# EAGLE design u-nex_v1 (EAGLE 6.5.0)
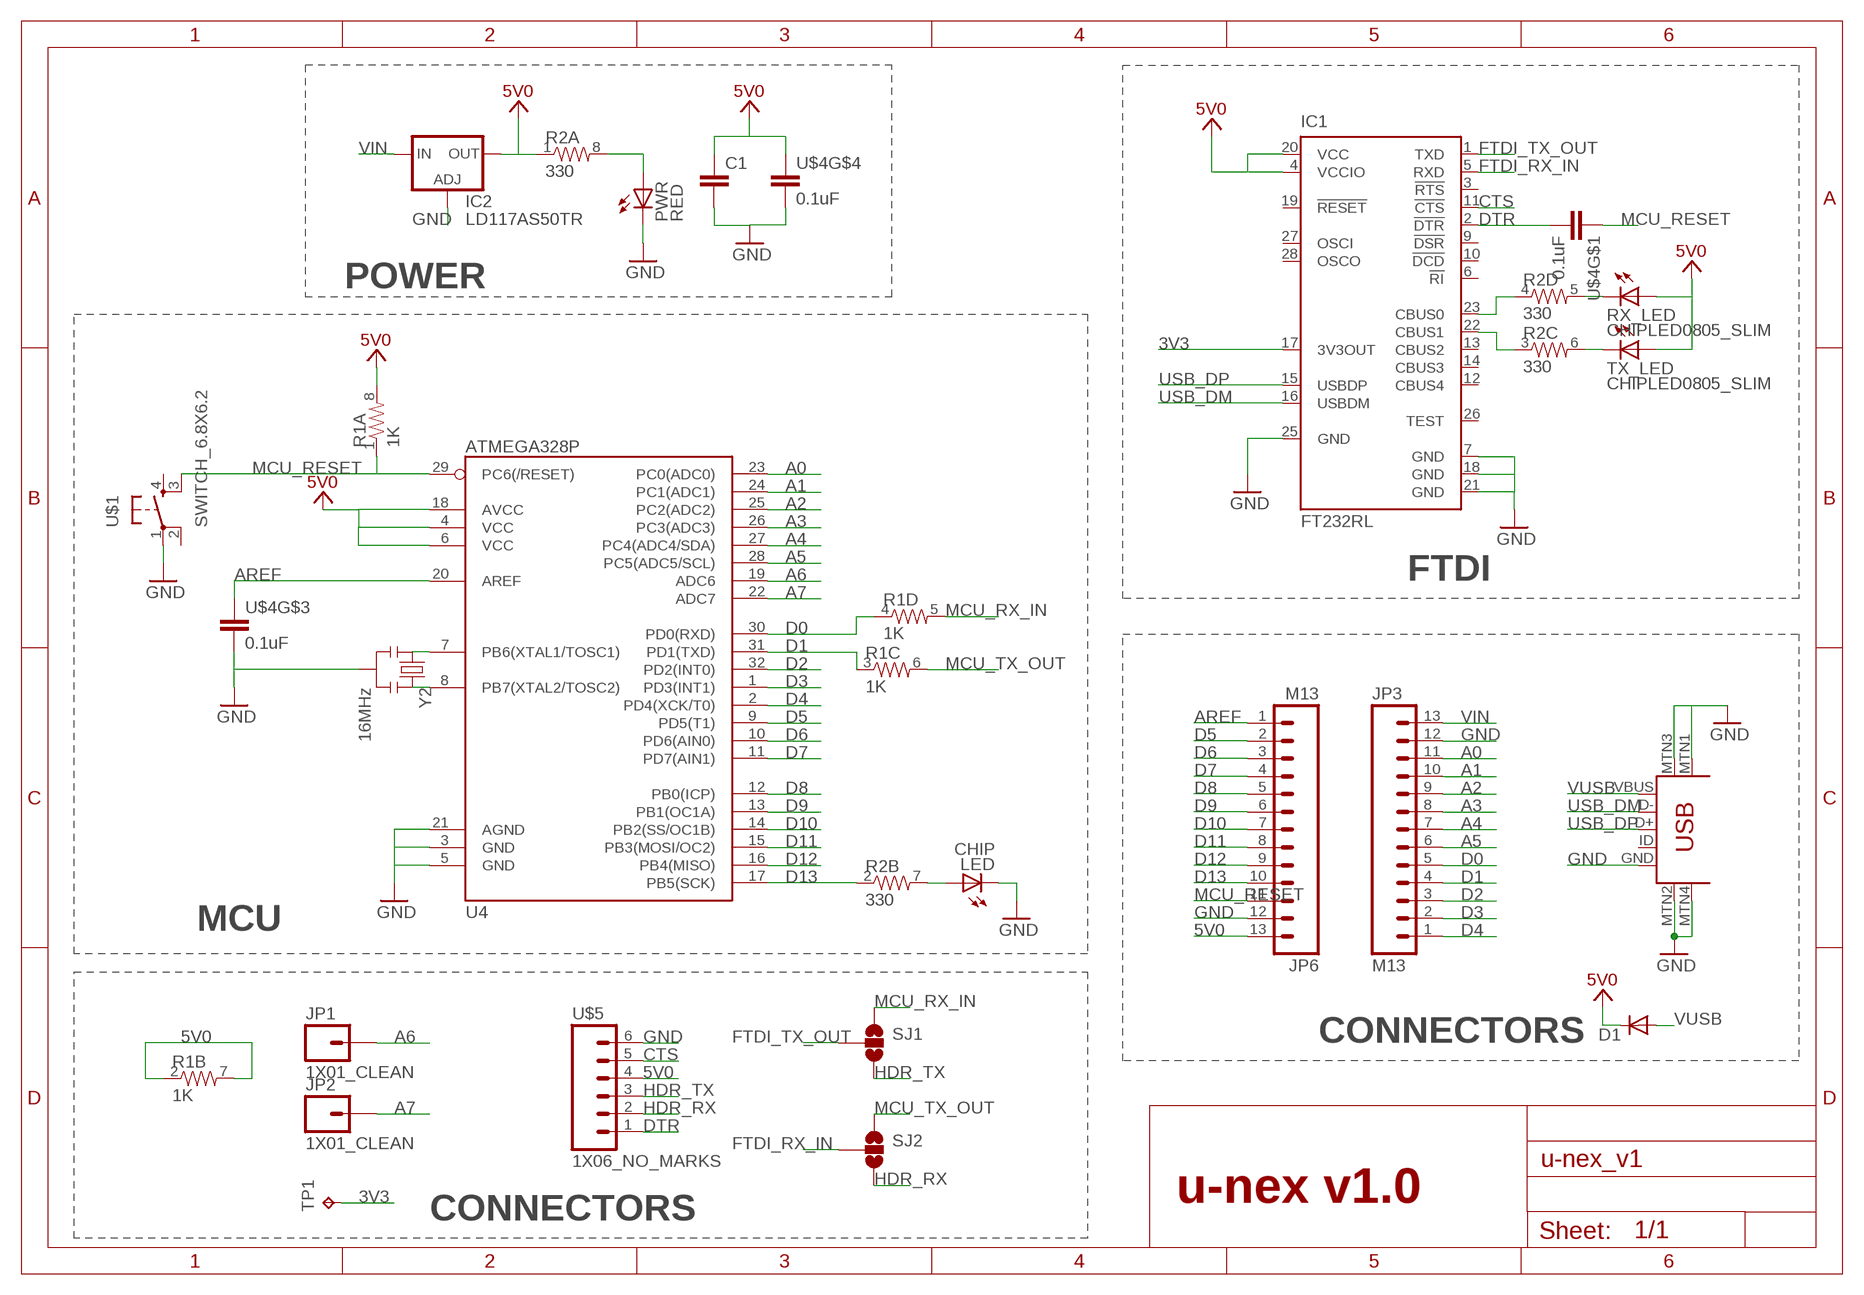
[diagram p0: schematic, sheet 1]

## Parts
C1  CAP0805  [0805]
D1  DIODESOD  [SOD-323]
IC1  FT232RL  [SSOP28]
IC2  LD117AS50TR  [SOT223]
JP1  1X01_CLEAN  [1X01_CLEAN]
JP2  1X01_CLEAN  [1X01_CLEAN]
JP3  M13  [1X13]
JP6  M13  [1X13]
LED  CHIP  CHIPLED0805_SLIM  [CHIPLED0805]
PWR  RED  CHIPLED0805_SLIM  [CHIPLED0805]
R1  1K  RES_ARRAY_4X0603  [0603_ARV]
R2  330  RES_ARRAY_4X0603  [0603_ARV]
RX_LED  CHIPLED0805_SLIM  [CHIPLED0805]
SJ1  SOLDERJUMPER_2WAYS  [SJ_3]
SJ2  SOLDERJUMPER_2WAYS  [SJ_3]
TP1  TPB1,27  [B1,27]
TX_LED  CHIPLED0805_SLIM  [CHIPLED0805]
U4  ATMEGA328P  ATMEGA328_SMT  [TQFP32-08]
U$1  SWITCH_6.8X6.2  [SWITCH_6.8X6.2]
U$4  0.1uF  CAP_ARRAY_0603  [0603_ARV]
U$5  1X06_NO_MARKS  [1X06_CLEAN]
U$9  USB-MINIB-5PIN  [USB-MINIB]
Y2  16MHz  RESONATOR_SMD  [RESONATOR_SMD]

## Nets
3V3: IC1.17(3V3OUT) TP1.TP
5V0: C1.1 D1.1(C) IC1.4(VCCIO) IC1.20(VCC) IC2.4(OUT) JP6.13 R1.2 R1.7 R1.8 R2.1 RX_LED.A TX_LED.A U4.4(VCC) U4.6(VCC) U4.18(AVCC) U$4.4 U$5.4
A0: JP3.11 U4.23(PC0(ADC0))
A1: JP3.10 U4.24(PC1(ADC1))
A2: JP3.9 U4.25(PC2(ADC2))
A3: JP3.8 U4.26(PC3(ADC3))
A4: JP3.7 U4.27(PC4(ADC4/SDA))
A5: JP3.6 U4.28(PC5(ADC5/SCL))
A6: JP1.1 U4.19(ADC6)
A7: JP2.1 U4.22(ADC7)
AREF: JP6.1 U4.20(AREF) U$4.3
CTS: IC1.11(!CTS) U$5.5
D0: JP3.5 R1.4 U4.30(PD0(RXD))
D1: JP3.4 R1.3 U4.31(PD1(TXD))
D2: JP3.3 U4.32(PD2(INT0))
D3: JP3.2 U4.1(PD3(INT1))
D4: JP3.1 U4.2(PD4(XCK/T0))
D5: JP6.2 U4.9(PD5(T1))
D6: JP6.3 U4.10(PD6(AIN0))
D7: JP6.4 U4.11(PD7(AIN1))
D8: JP6.5 U4.12(PB0(ICP))
D9: JP6.6 U4.13(PB1(OC1A))
D10: JP6.7 U4.14(PB2(SS/OC1B))
D11: JP6.8 U4.15(PB3(MOSI/OC2))
D12: JP6.9 U4.16(PB4(MISO))
D13: JP6.10 R2.2 U4.17(PB5(SCK))
DTR: IC1.2(!DTR) U$4.8 U$5.1
FTDI_RX_IN: IC1.5(RXD) SJ2.2
FTDI_TX_OUT: IC1.1(TXD) SJ1.2
GND: C1.2 IC1.7(GND) IC1.18(GND) IC1.21(GND) IC1.25(GND) IC2.1(ADJ) JP3.12 JP6.12 LED.C PWR.C U4.3(GND) U4.5(GND) U4.21(AGND) U$1.1 U$4.5 U$4.6 U$5.6 U$9.GND U$9.MTN1(MTN2) U$9.MTN2(MTN3) U$9.MTN3(MTN1) U$9.MTN4 Y2.2
HDR_RX: SJ2.3 U$5.2
HDR_TX: SJ1.3 U$5.3
MCU_RESET: JP6.11 R1.1 U4.29(PC6(/RESET)) U$1.3 U$4.1
MCU_RX_IN: R1.5 SJ1.1
MCU_TX_OUT: R1.6 SJ2.1
N$1: LED.A R2.7
N$2: R2.5 RX_LED.C
N$3: R2.6 TX_LED.C
N$5: IC1.22(CBUS1) R2.3
N$33: IC1.23(CBUS0) R2.4
N$35: PWR.A R2.8
N$54: U4.7(PB6(XTAL1/TOSC1)) Y2.1
N$55: U4.8(PB7(XTAL2/TOSC2)) Y2.3
USB_DM: IC1.16(USBDM) U$9.D-
USB_DP: IC1.15(USBDP) U$9.D+
VIN: IC2.3(IN) JP3.13
VUSB: D1.2(A) U$9.VBUS
Unconnected: IC1.3(!RTS) IC1.6(!RI) IC1.9(!DSR) IC1.10(!DCD) IC1.12(CBUS4) IC1.13(CBUS2) IC1.14(CBUS3) IC1.19(!RESET) IC1.26(TEST) IC1.27(OSCI) IC1.28(OSCO) U$1.2 U$1.4 U$4.2 U$4.7 U$9.ID

## Notes on the sheet
- POWER
- FTDI
- MCU
- CONNECTORS
- u-nex v1.0
- CONNECTORS

## Library data of the parts
C1 = SparkFun-Capacitors:CAP: Capacitor Standard 0603 ceramic capacitor, and 0.1" leaded capacitor.
D1 = SparkFun-DiscreteSemi:DIODE: Diode These are standard reverse protection diodes and small signal diodes. SMA package can handle up to about 1A. SOD-323 can handle about 200mA. What the SOD-323 package when ordering, there are some mfgs out there that are 5-pin packages.
IC1 = ftdichip:FT232R: Source: http://www.ftdichip.com/Documents/DataSheets/DS_FT232R_v104.pdf; MPN: FT232RL; OC_FARNELL: 1146032; OC_NEWARK: 91K9918
IC2 = v-reg:LD117A?*: Low drop fixed and adjustable positive voltage regulators 1 A Source: http://www.st.com/stonline/products/literature/ds/7194/ld1117axx.pdf
JP1 JP2 = Frenoy_Custom:1X01_CLEAN
JP3 JP6 = Frenoy_custom_GOA:M13
LED PWR RX_LED TX_LED = Frenoy_Custom:CHIPLED0805_SLIM
R1 R2 = Frenoy_Custom:RES_ARRAY_4X0603
SJ1 SJ2 = SparkFun-Passives:SOLDERJUMPER_2WAY: Solder Jumper 2 way solder jumper
TP1 = testpad:TP: Test pad
U4 = SparkFun-DigitalIC:ATMEGA328_SMT: 32-Pin Atmega328 part Commonly used on Arduino compatible boards Available in QFP and QFN packages TQFP is IC-09069 QFN is non-stock; PROD_ID: IC-09069
U$1 = Frenoy_Custom:SWITCH_6.8X6.2
U$4 = Frenoy_Custom:CAP_ARRAY_0603
U$5 = Frenoy_Custom:1X06_NO_MARKS
U$9 = SparkFun-Connectors:USB-MINIB: Mini-USB "B" connector with 5th pin broken out. Created new symbol breaking out 5th "ID" pin in mini/micro USB connector spec. See: http://en.wikipedia.org/wiki/Mini_usb#Cables. Uses same footprint as 4-pin symbol. Also added pins to connect to mounting / shield pads if required (probably not generally needed as signals aren't shielded once they leave the connector).
Y2 = Frenoy_custom_GOA:RESONATOR_SMD

## Board
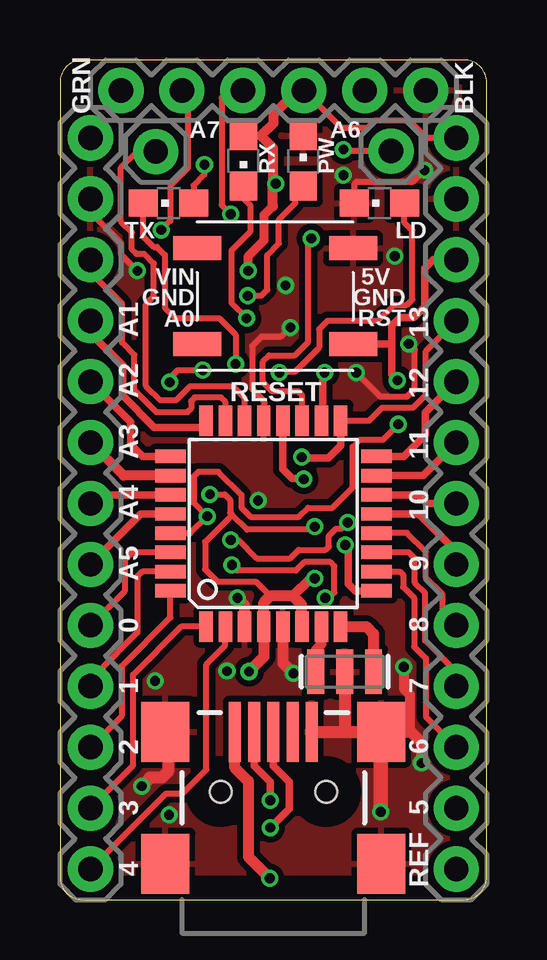
[diagram p1: board, top side]
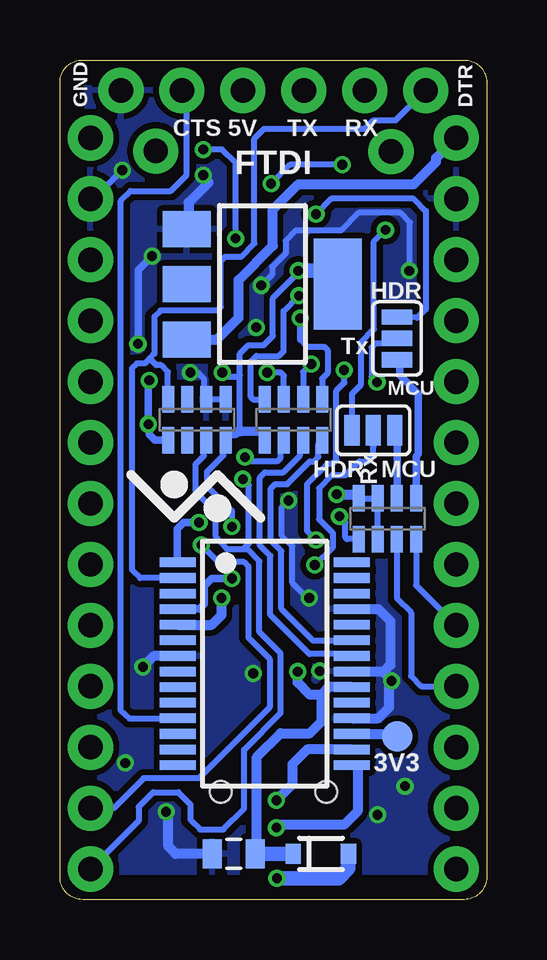
[diagram p2: board, bottom side, seen from below]

Size 17.78 x 35 mm. Coordinates in mm from the lower left corner, seen from the top.
Outline: 17.78,0.94 17.78,34.06 arc90 16.84,35 0.94,35 arc90 0,34.06 0,0.94 arc90 0.94,0 16.84,0 arc90 17.78,0.94
Copper layers (1*16): Top 0.035mm / dielectric 1.5mm / Bottom 0.035mm
Design rules "default": minimum track width 10mil, minimum drill 16mil, track to track 8mil, track to pad 8mil, pad to pad 8mil, via to via 8mil, smd to smd 8mil, copper to edge 40mil, drill to drill 8mil, minimum pad ring 10mil, minimum via ring 6mil, stop-mask expansion 4mil, vias tented up to drill 16mil, thermal gap 10mil

### Footprints (pad centres in the part's own frame; a part is rotated, then mirrored left to right if it is on the bottom)
0805 = smd 0.8 x 1.2: 1 -0.9,0; 2 0.9,0
SOD-323 = smd 0.63 x 0.83: 1 -1.15,0; 2 1.15,0
SSOP28 = smd 0.4 x 1.5: 1 -4.225,-3.625; 2 -3.575,-3.625; 3 -2.925,-3.625; 4 -2.275,-3.625; 5 -1.625,-3.625; 6 -0.975,-3.625; 7 -0.325,-3.625; 8 0.325,-3.625; 9 0.975,-3.625; 10 1.625,-3.625; 11 2.275,-3.625; 12 2.925,-3.625; 13 3.575,-3.625; 14 4.225,-3.625; 15 4.225,3.625; 16 3.575,3.625; 17 2.925,3.625; 18 2.275,3.625; 19 1.625,3.625; 20 0.975,3.625; 21 0.325,3.625; 22 -0.325,3.625; 23 -0.975,3.625; 24 -1.625,3.625; 25 -2.275,3.625; 26 -2.925,3.625; 27 -3.575,3.625; 28 -4.225,3.625
SOT223 = smd 1.5 x 2: 1 -2.3,-3.15; 2 0,-3.15; 3 2.3,-3.15 | smd 3.8 x 2: 4 0,3.15
1X01_CLEAN = drill 1.016 pad 1.88: 1 0,0
1X13 = drill 1.016 pad 1.88: 1 0,0; 2 2.54,0; 3 5.08,0; 4 7.62,0; 5 10.16,0; 6 12.7,0; 7 15.24,0; 8 17.78,0; 9 20.32,0; 10 22.86,0; 11 25.4,0; 12 27.94,0; 13 30.48,0
CHIPLED0805 = smd 1.143 x 1.2: A 0,-1.05; C 0,1.05
0603_ARV = smd 0.5 x 1.1: 1 -1.2,-0.85; 2 -0.4,-0.85; 3 0.4,-0.85; 4 1.2,-0.85; 5 1.2,0.85; 6 0.4,0.85; 7 -0.4,0.85; 8 -1.2,0.85
SJ_3 = smd 0.635 x 1.27: 1 -0.889,0; 2 0,0; 3 0.889,0
B1,27 = smd 1.27 x 1.27: TP 0,0
TQFP32-08 = smd 1.27 x 0.559: 1 -4.293,2.8; 2 -4.293,2; 3 -4.293,1.2; 4 -4.293,0.4; 5 -4.293,-0.4; 6 -4.293,-1.2; 7 -4.293,-2; 8 -4.293,-2.8; 17 4.293,-2.8; 18 4.293,-2; 19 4.293,-1.2; 20 4.293,-0.4; 21 4.293,0.4; 22 4.293,1.2; 23 4.293,2; 24 4.293,2.8 | smd 0.559 x 1.27: 9 -2.8,-4.293; 10 -2,-4.293; 11 -1.2,-4.293; 12 -0.4,-4.293; 13 0.4,-4.293; 14 1.2,-4.293; 15 2,-4.293; 16 2.8,-4.293; 25 2.8,4.293; 26 2,4.293; 27 1.2,4.293; 28 0.4,4.293; 29 -0.4,4.293; 30 -1.2,4.293; 31 -2,4.293; 32 -2.8,4.293
SWITCH_6.8X6.2 = smd 1 x 2: 1 -2,3.25; 2 -2,-3.25; 3 2,3.25; 4 2,-3.25
1X06_CLEAN = drill 1.016 pad 1.88: 1 -6.35,0; 2 -3.81,0; 3 -1.27,0; 4 1.27,0; 5 3.81,0; 6 6.35,0
USB-MINIB = smd 2.5 x 0.5: D+ 2.5,0; D- 2.5,0.8; GND 2.5,-1.6; ID 2.5,-0.8; VBUS 2.5,1.6 | smd 2.5 x 2: MTN1 -3,4.5; MTN2 2.5,4.5; MTN3 -3,-4.5; MTN4 2.5,-4.5 | hole 0.9: 0,2.2; 0,-2.2
RESONATOR_SMD = smd 0.7 x 1.854: 1 -1.2,0; 2 0,0; 3 1.2,0

### Placement (x,y rotation side)
C1  10.54,1.91 180 bottom
D1  6.91,1.91 0 bottom
IC1  9.25,9.83 270 bottom
IC2  9.35,25.65 270 bottom
JP1  13.79,31.2 0 top
JP2  3.99,31.18 0 top
JP3  1.27,1.27 90 top
JP6  16.51,1.27 90 top
LED  13.31,29.03 90 top
PWR  10.13,30.78 0 top
R1  4.14,15.88 0 bottom
R2  8.05,20 0 bottom
RX_LED  7.65,30.78 180 top
SJ1  3.73,23.39 90 bottom
SJ2  4.72,19.56 180 bottom
TP1  3.73,6.81 0 bottom
TX_LED  4.52,29.03 90 top
U4  8.89,15.67 90 top
U$1  8.97,25.15 270 top
U$4  12.08,20 0 bottom
U$5  8.89,33.73 0 top
U$9  8.89,4.5 90 top
Y2  11.86,9.5 0 top

### Tracks (layer width: path | path; a pad name or v marks a point on that pad's centre or on a via)
3V3
  Bottom 0.406: 3.71,6.63 TP1.TP | 3.55,6.91 TP1.TP | IC1.17 3.83,6.91 TP1.TP
5V0  (via drill 0.41, 0.41 pad 0.64, 0.41 pad 0.71)
  Top 0.254: 8.76,12.65 8.15,13.26 6.55,13.26 6.04,13.77 6.04,14.91 7.18,16.04 | JP6.13 15.29,31.75 14.55,32.47 13.12,32.47 12.8,32.16 11.73,32.16 U$5.4 | v10.62,15.54 10.49,15.42 7.8,15.42 7.18,16.04 | v6.25,16.89 6.86,16.89 7.09,16.66 7.09,16.13 7.18,16.04 | v6.02,30.63 6.02,30.23 5.56,29.77 5.56,29.04 TX_LED.A
  Top 0.305: U4.18 10.85,20.09 10.95,19.56 10.95,21.89 v11.02,21.97 | 8.37,31.84 RX_LED.A
  Top 0.381: v7.85,26.21 7.85,26.82 8.51,27.48 8.51,28.55 8.87,28.91
  Top 0.406: v10.62,13.39 10.44,13.39 9.7,12.65 | U$5.4 9.9,33.73 8.89,32.72 8.89,32.35 8.37,31.84 8.87,31.34 8.87,29.97 v8.99,29.85 8.87,29.73 8.87,28.91
  Top 0.457: v7.87,9.5 8.49,10.12 U4.4 8.49,12.38 8.76,12.65 9.7,12.65 | 9.7,12.65 10.06,12.29 10.06,11.41 U4.6 | 9.7,12.65 9.73,12.65
  Bottom 0.254: R1.2 R1.7 R1.8 | 10.85,19.13 U$4.4 10.97,19.04 10.97,18.52 11.66,17.83 11.66,17.25 10.62,16.2 v10.62,15.54 | 10.29,19.58 10.29,21.84 | 10.29,21.84 10.29,22.76 9.93,23.11 9.3,23.11 8.91,23.5 8.91,25.07 7.85,26.14 v7.85,26.21 | v11.02,21.97 10.87,21.81 10.29,21.81 10.29,21.84 | v6.02,30.63 8.2,30.63 v8.99,29.85
  Bottom 0.305: IC1.4 11.97,12.11 11.76,12.32 11.76,13.08 11.46,13.39 v10.62,13.39
  Bottom 0.381: R2.1 9.2,19.49 9.22,19.51 10.21,19.51 10.29,19.58 10.44,19.43 10.87,19.43 U$4.4
  Bottom 0.406: 9.65,1.84 C1.1 | 9.63,1.84 C1.1 | C1.1 9.58,1.97 9.58,5.94 8.59,6.93 7.37,6.93 6.88,7.42 6.88,8.48 6.93,8.53 | IC1.20 6.56,8.86 6.88,8.53 6.93,8.53 | 6.93,8.53 7.37,8.53 7.87,9.04 v7.87,9.5 | v6.25,16.89 5.51,16.89 R1.8
  Bottom 0.61: 5.61,25.58 IC2.4 6.68,26.21 v7.85,26.21 | C1.1 D1.1
  Bottom 0.66: 6.38,25.86 IC2.4
A0
  Top 0.254: JP3.11 1.27,26.16 2.59,24.84 2.59,23.22 3.1,22.71 3.1,21.23 4.01,20.32 5.31,20.32 5.46,20.47 5.46,20.78 5.61,20.93 6.71,20.93 6.88,20.75 U4.23
A1
  Top 0.305: JP3.10 1.27,23.62 2.62,22.28 2.62,21.01 3.94,19.68 5.99,19.68 6.09,19.78 U4.24
A2
  Top 0.305: U4.25 3.45,18.47 2.95,18.97 2.95,19.91 JP3.9
A3
  Top 0.406: U4.26 2.65,17.67 JP3.8
A4
  Top 0.305: U4.27 1.63,16.87 JP3.7
A5
  Top 0.305: U4.28 3.37,16.07 JP3.6
A6  (via drill 0.41, 0.41 pad 0.71)
  Top 0.254: U4.19 10.09,21.02 9.93,21.18 8.84,21.18 8.46,21.57 8.46,22.43 8.71,22.68 9.78,22.68 10.34,23.24 10.34,27.43 v10.46,27.56 | JP1.1 11.87,31.2 v11.81,31.27
  Bottom 0.254: v10.46,27.56 10.46,30.71 11.02,31.27 v11.81,31.27
A7
  Top 0.254: U4.22 7.69,20.91 7.21,21.39 5.41,21.39 4.83,20.8 4.19,20.8 3.58,21.41 3.58,24.82 3.91,25.15 3.91,26.52 3.5,26.92 3.17,26.92 3,27.1 3,27.81 2.54,28.27 2.54,30.5 3.2,31.17 3.97,31.17 JP2.1
AREF  (via drill 0.41 pad 0.71)
  Top 0.305: U4.20 9.29,17.94 9.68,17.55 10.13,17.55 v10.16,17.52
  Bottom 0.254: JP6.1 14.5,3.28 14.5,3.86 13.89,4.47 12.85,4.47 12.34,3.96 12.34,3.33 11.94,2.92 10.97,2.92 10.11,3.79 10.11,6.25 8.59,7.77 8.59,10.26 9.47,11.15 9.47,14.1 9.98,14.61 10.13,14.61 | 11.68,19.13 U$4.3 11.79,19.03 11.79,18.49 12.14,18.14 12.14,17.02 11.3,16.18 11.3,15.16 10.82,14.61 10.13,14.61 | 10.13,14.61 9.91,14.83 9.91,17.27 v10.16,17.52
CTS
  Bottom 0.254: 12.6,7.59 IC1.11 | 12.91,7.54 IC1.11 | IC1.11 12.88,7.54 14.88,7.54 15.24,7.87 15.24,29.13 14.83,29.54 13.16,29.54 12.5,30.2 12.5,33.53 U$5.5
D0
  Top 0.254: U4.30 3.02,14.47 2.69,14.15 2.69,12.85 JP3.5
  Bottom 0.254: R1.4 2.94,13.1 JP3.5
D1
  Top 0.254: U4.31 3.44,13.67 3.23,13.46 3.23,11.12 1.57,9.47 1.57,9.2 JP3.4
  Bottom 0.254: JP3.4 2.72,8.89 3.15,9.32 3.15,11.96 3.74,12.55 R1.3
D2
  Top 0.254: JP3.3 2.56,7.64 2.56,9.73 4.6,11.76 U4.32
D3
  Top 0.254: JP3.2 3.05,5.59 3.05,9.37 5.05,11.38 U4.1
D4
  Top 0.254: JP3.1 4.42,4.42 5.11,4.42 6.1,5.41 6.1,9.8 6.88,10.59 U4.2
D5  (via drill 0.41 pad 0.71)
  Top 0.305: U4.9 12.3,12.87 12.01,13.16 12.01,14.66 v11.89,14.78
  Bottom 0.254: v11.89,14.78 11.18,14.07 10.11,14.07 9.93,13.89 9.93,10.92 9.04,10.03 9.04,8 11.99,5.05 14.3,5.05 15.54,3.81 JP6.2
D6
  Top 0.254: JP6.3 15.24,7.62 15.24,10.06 14.76,10.54 14.76,12.57 14.3,13.03 14.3,13.54 14.17,13.67 U4.10
D7
  Top 0.254: JP6.4 16.51,9.5 15.21,10.79 15.21,12.78 14.78,13.21 14.78,14.22 14.53,14.48 U4.11
D8
  Top 0.254: JP6.5 15.93,12.01 15.93,12.75 15.24,13.44 15.24,14.5 14.45,15.29 13.2,15.29 U4.12
  Top 0.305: 13.23,15.39 U4.12
D9
  Top 0.305: U4.13 14.94,16.07 16.48,14.53 16.48,13.99 JP6.6
D10
  Top 0.305: U4.14 14.93,16.87 15.29,16.51 JP6.7
D11
  Top 0.254: 13.37,17.78 U4.15 | 13.26,17.83 U4.15 | 13.27,17.73 U4.15
  Top 0.305: U4.15 15.13,17.67 JP6.8
D12
  Top 0.305: U4.16 14.33,18.47 15.21,19.36 15.21,20.3 JP6.9
D13  (via drill 0.41 pad 0.71)
  Top 0.254: U4.17 12.88,19.96 13.41,20.5 14.71,20.5 15.24,21.03 15.24,22.86 JP6.10
  Top 0.305: U4.17 11.69,18.93 11.18,18.41 10.1,18.41 v10.07,18.44
  Bottom 0.254: R2.2 8.59,19.02 8.59,18.41 8.74,18.26 9.89,18.26 v10.07,18.44
DTR
  Bottom 0.254: 13.26,21.05 13.23,20.57 | IC1.2 14.45,13.4 14.78,13.74 14.78,22.15 14.58,22.35 14.25,22.35 14.05,22.55 | U$4.8 13.28,20.87 13.28,22 13.56,22.28 13.77,22.28 14.05,22.55 | 14.05,22.55 13.84,22.76 13.84,24.31 13.59,24.56 11.23,24.56 11.07,24.71 11.07,26.62 10.9,26.8 10.24,26.8 9.68,27.36 9.68,31.73 9.27,32.13 5.08,32.13 4.72,32.49 3.79,32.49 U$5.1
  Bottom 0.305: 13.26,21.05 U$4.8
FTDI_RX_IN  (via drill 0.41 pad 0.64, 0.41 pad 0.71)
  Top 0.254: v11.05,12.57 11.2,12.57 11.43,12.8 11.43,13.89 11.25,14.07 10.19,14.07 9.83,13.72 7.39,13.72 v7.16,13.95
  Bottom 0.254: v7.16,13.95 6.4,14.71 6.4,15.27 6.99,15.85 6.99,17.14 6.45,17.68 5.89,17.68 5.31,18.26 4.95,18.26 4.72,18.49 SJ2.2 4.72,18.87
  Bottom 0.406: IC1.5 11.46,11.46 11.05,11.86 v11.05,12.57
FTDI_TX_OUT  (via drill 0.41 pad 0.64, 0.41 pad 0.71)
  Top 0.254: v11.99,15.72 11.73,15.47 11.51,15.47 11.2,15.16 11.2,14.71 11.07,14.58 9.96,14.58 9.6,14.22 8.2,14.22 7.44,14.99 v7.11,14.99 | v4.57,21.57 4.57,21.74 4.9,22.07 v5.94,22.07
  Bottom 0.254: v4.57,21.57 4.8,21.79 4.8,23.01 4.62,23.19 3.79,23.19 SJ1.2 | v7.11,14.99 7.49,15.37 7.49,17.32 6.66,18.16 6.43,18.16 6.26,18.33 6.26,21.22 5.93,21.55 v5.93,22.06 v5.94,22.07
  Bottom 0.305: IC1.1 12.9,14.06 12.9,15.44 12.62,15.72 v11.99,15.72
GND  (via drill 0.41, 0.41 pad 0.64, 0.41 pad 0.71)
  Top 0.254: 13.62,1.14 13.62,1.27 U$9.MTN3 | U4.21 8.51,19.98 8.51,20.78 8,21.29 8,23.06 8.41,23.47 9.22,23.47 v9.6,23.85 | JP3.12 1.27,28.65 2.54,27.38 2.54,26.9 v3.23,26.21 | v15.19,30.4 14.72,29.93 12.38,29.93 12.27,29.82 12.27,29.04 LED.C | v14.53,23.16 14.78,22.91 14.78,21.29 14.45,20.95 13.36,20.95 v12.34,21.97
  Top 0.406: 10.49,6.98 U$9.GND | v14.33,9.7 14.33,8.79 14.58,8.53 14.58,7.04 14.62,7
  Top 0.457: U$9.MTN4 14.12,7 14.62,7 15.06,6.55 v15.06,5.69 | U4.5 9.29,9.86 v9.73,9.42 | 7.37,12.57 v7.39,12.57 7.67,12.29 7.67,11.53
  Top 0.508: U$9.GND 11.86,7 | 11.86,7 U$9.MTN4 | Y2.2 11.86,7 | 4.5,6.08 4.5,5.34 4.24,5.08 3.76,5.08 v3.4,4.72
  Top 0.61: 13.82,1.14 13.62,1.14 | 13.3,6.99 U$9.MTN4 | 13.3,7.01 U$9.MTN4 | 14.1,7.02 14.12,7 | v13.36,3.66 13.36,6.97 U$9.MTN4
  Bottom 0.254: v12.34,21.97 12.04,21.97 11.79,21.72 11.79,20.97 U$4.6 U$4.5 | v7.39,12.57 7.47,12.57 8.1,13.21 8.1,14.73 8.53,15.16 8.53,16.36 v8.26,16.64 | JP6.12 16.38,29.21 v15.19,30.4 | v9.4,25.6 8.94,26.06 8.94,26.36 8.38,26.92 8.38,27.46 7.95,27.89 6.07,27.89 5.33,28.63 3.61,28.63 3.2,28.22 3.2,26.24 v3.23,26.21
  Bottom 0.305: v14.53,23.16 14.53,26.24 v13.95,26.82
  Bottom 0.406: 11.48,1.87 C1.2 12.96,1.91 13.26,2.21 13.26,3.56 v13.36,3.66 | IC1.18 4.51,7.55 4.06,8 4.06,9.27 4.29,9.5 | 4.29,9.5 5.39,9.5 IC1.21 | IC1.25 4.51,12.11 4.01,11.61 4.01,9.78 4.29,9.5 | IC1.7 13.87,10.15 v14.33,9.7 | v11.81,30.2 11.58,29.9 12.42,29.06 12.42,27.95 IC2.1
  other vias: 4.55,3.53 6.96,9.53 3.96,9.12
  pour Top (isolate 0.254): -0.08,35.05 18.69,35.05 18.75,-0.05 -0.33,0
  pour Bottom (isolate 0.254): -0.2,35.05 17.86,34.92 17.86,-0.13 -0.33,0
HDR_RX  (via drill 0.41 pad 0.71)
  Top 0.254: v4.22,27.91 4.6,28.3 4.6,29.77 5.33,30.5 5.33,33.48 U$5.2
  Bottom 0.254: SJ2.3 5.61,21.08 5.26,21.44 5.26,23.22 4.7,23.77 4.7,27.43 v4.22,27.91
HDR_TX  (via drill 0.41)
  Top 0.254: U$5.3 7.04,33.73 6.73,33.43 6.73,28.96 v7.11,28.57
  Bottom 0.254: SJ1.3 2.9,24.26 2.54,24.61 2.54,28.7 3.05,29.21 6.48,29.21 v7.11,28.57
MCU_RESET  (via drill 0.41 pad 0.64, 0.41 pad 0.71)
  Top 0.254: U4.29 5.43,15.27 v6.13,15.98 5.56,16.55 5.56,17.63 5.77,17.83 6.6,17.83 7.57,16.87 7.57,16.33 7.95,15.95 9.96,15.95 10.34,16.33 11.35,16.33 12.19,17.17 12.19,18.87 12.5,19.18 13.46,19.18 v14.1,19.81
  Top 0.305: U$1.3 13.79,23.15 13.82,23.09 | JP6.11 15.54,26.67 15.19,26.31 15.19,24.71 14.73,24.26 14.15,24.26 13.82,23.93 13.82,23.09 | 13.82,23.09 13.82,21.88 v14.06,21.64
  Bottom 0.254: R1.1 5.24,15.16 | R1.1 5.35,15.24 5.35,15.32 | 5.35,15.21 R1.1 | R1.1 5.83,15.03 5.89,15.09 5.89,15.73 v6.13,15.98
  Bottom 0.305: U$4.1 13.84,19.15 14.07,19.38 v14.1,19.81 14.1,21.6 v14.06,21.64
MCU_RX_IN
  Bottom 0.305: R1.5 2.95,16.93 2.95,18.47 2.85,18.57 2.85,21.08 3.63,21.87 3.63,22.38 SJ1.1
MCU_TX_OUT
  Bottom 0.305: R1.6 3.73,16.93 3.73,19.41 SJ2.1 3.83,19.63
N$1  (via drill 0.41 pad 0.71)
  Top 0.254: 14.07,28.85 LED.A 14.35,29.07 14.35,28.22 14.68,27.89 14.68,25.02 14.45,24.79 13.92,24.79 13.26,24.13 11.15,24.13 10.79,23.77 10.79,23.01 9.78,22 9.14,22 v9.14,21.97
  Bottom 0.254: R2.7 8.45,21.84 8.59,21.97 v9.14,21.97
N$2  (via drill 0.41 pad 0.71)
  Top 0.254: RX_LED.C 7.64,29.23 7.92,28.96 7.92,27.84 7.14,27.05 7.14,24.87 v7.77,24.23
  Bottom 0.254: R2.5 6.86,21.72 6.63,21.95 6.63,22.91 6.76,23.04 7.47,23.04 7.77,23.34 v7.77,24.23
N$3  (via drill 0.41 pad 0.71)
  Top 0.254: v7.32,22.33 7.32,23.55 6.63,24.23 4.8,24.23 4.37,24.66 4.37,26.87 4.04,27.2 3.91,27.2 3.45,27.66 3.45,29.02 TX_LED.C 3.48,28.99
  Bottom 0.254: 7.26,22.38 v7.32,22.33 7.64,22 R2.6
N$5
  Bottom 0.254: IC1.22 5.42,10.24 7.39,10.24 9.02,11.86 9.02,14.33 9.45,14.76 9.45,17.6 9.25,17.8 8.48,17.8 7.77,18.52 7.77,19.03 R2.3 | 7.7,19.15 R2.3 | 7.72,19.03 R2.3 | 7.77,19.05 R2.3
N$33
  Bottom 0.254: 5.33,10.87 5.51,10.87 5.45,10.8 IC1.23 5.66,10.79 7.24,10.79 8.56,12.12 8.56,14.53 8.99,14.96 8.99,17.14 8.81,17.32 8.31,17.32 7.37,18.26 7.21,18.26 7.01,18.47 7.01,18.99 R2.4 | 6.92,19.15 R2.4 | 6.99,19.07 R2.4
N$35  (via drill 0.41 pad 0.71)
  Top 0.254: v7.82,25.17 8.38,25.17 8.64,25.43 8.64,26.87 9.12,27.36 9.12,28.35 9.8,29.03 9.8,29.41 PWR.A | 10.13,29.36 PWR.A | 10.12,29.34 PWR.A
  Bottom 0.254: R2.8 9.2,20.85 9.73,20.85 9.83,20.95 9.83,22.43 9.6,22.66 8.66,22.66 8.46,22.86 8.46,24.54 v7.82,25.17
N$54
  Top 0.406: U4.7 10.89,10.64 10.67,10.41 10.67,9.46 Y2.1
  Top 0.457: 10.56,9.4 Y2.1
N$55
  Top 0.457: U4.8 12.75,11.38 13.06,11.07 13.06,9.46 Y2.3
USB_DM  (via drill 0.41 pad 0.71)
  Top 0.305: 8.1,6.99 U$9.D- 8.1,6.98 8.1,5.56 8.76,4.9 v8.76,4.14
  Bottom 0.406: IC1.16 7.49,6.25 8.1,5.64 8.1,4.8 v8.76,4.14
USB_DP  (via drill 0.41 pad 0.71)
  Top 0.305: U$9.D+ 8.89,5.56 9.55,4.9 9.55,3.79 v8.76,3
  Bottom 0.254: IC1.15 5.4,5.61 5.38,5.59
  Bottom 0.406: 5.38,5.59 5.38,3.68 5.94,3.12 8.64,3.12 v8.76,3
VIN
  Bottom 0.406: IC2.3 11.24,23.35 10.34,24.26 10.34,25.83 8.91,27.25 8.91,28.75 7.85,29.82 3.05,29.82 2.11,30.76 2.11,30.91 JP3.13
VUSB  (via drill 0.41 pad 0.71)
  Top 0.457: v8.74,0.89 7.85,1.78 7.85,4.93 7.29,5.49 7.29,6.99 U$9.VBUS
  Bottom 0.61: v8.74,0.89 6.17,0.89 5.77,1.29 5.77,1.9 D1.2

### Text on the board
tPlace: GRN | BLK | A7 | A6 | VIN | 5V | A0 | GND | GND | RST | A1 | 13 | A2 | 12 | A3 | 11 | A4 | 10 | 9 | A5 | 0 | 8 | 1 | 7 | 2 | 6 | 3 | 5 | 4 | REF
bPlace: DTR | GND | RX | TX | 5V | CTS | FTDI | 3V3
tNames: RX | PW | TX | LD | RESET
bNames: HDR | Tx | MCU | MCU | HDR | Rx